# Altium schematic sheet v3.0.SchDoc
size 215 x 114 mm
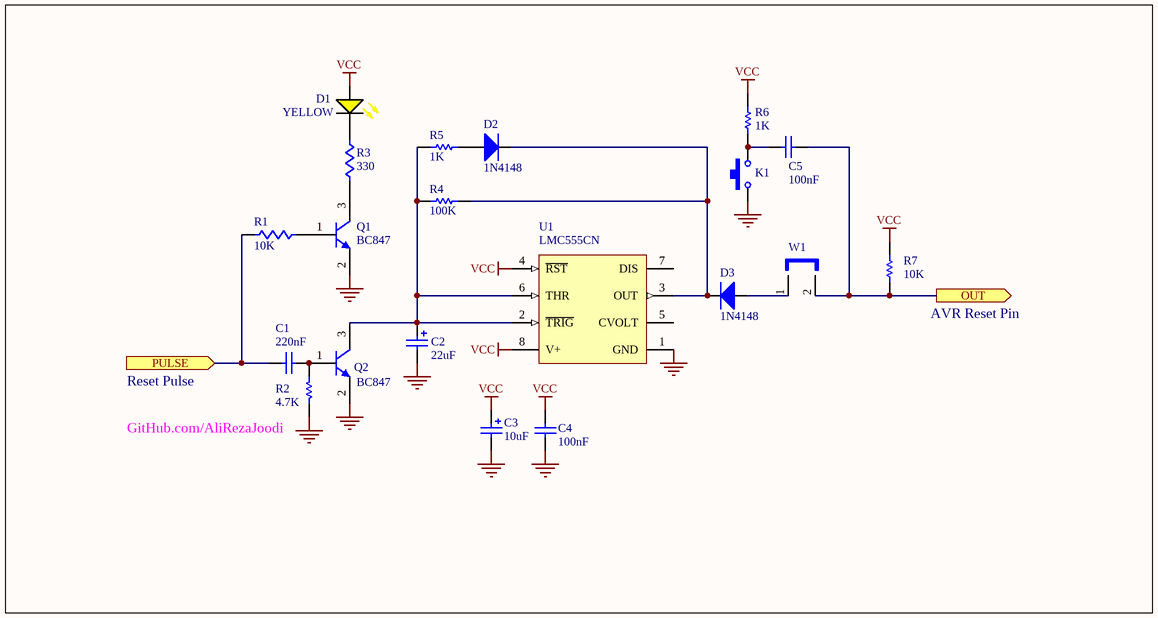
[diagram p0: v3.0.SchDoc]

## Parts
C1  value 220nF  [RESC3216N]  (hidden comment: Cap)
C2  value 22uF  [Cap_B]  (hidden comment: Capacitor)
C3  value 10uF  [Cap_B]  (hidden comment: Capacitor)
C4  value 100nF  [0805]  (hidden comment: Cap)
C5  value 100nF  [0805]  (hidden comment: Cap)
D1  YELLOW  [LED_THD_3MM_YELLOW_R]
D2  value 1N4148  [0805_Diode]  (hidden comment: Diode)
D3  value 1N4148  [0805_Diode]  (hidden comment: Diode)
K1  Switch_SW-PB  [SWPBT_SPST_6X6X4]  (value not drawn)
Q1  value BC847  [SOT23-3N]  (hidden comment: NPN)
Q2  value BC847  [SOT23-3N]  (hidden comment: NPN)
R1  value 10K  [0805]  (hidden comment: RES)
R2  value 4.7K  [0805]  (hidden comment: Res1)
R3  value 330  [0805]  (hidden comment: RES)
R4  value 100K  [0805]  (hidden comment: Res1)
R5  value 1K  [0805]  (hidden comment: Res1)
R6  1K  [0805]
R7  value 10K  [0805]  (hidden comment: Res1)
U1  LMC555CN  [SOP127P636-8N]
W1  Jumper 2pin  [HDR1X2]  (value not drawn)

## Ports
OUT (out), PULSE (in)

## Nets
GND: C2.2 C3.2 C4.1 K1.1 Q1.2(E) Q2.2(E) R2.2 U1.1(GND)
VCC: C3.1 C4.2 D1.1(A) R6.1 R7.1 U1.4(~{RST}) U1.8(V+)
OUT: C5.1 R7.2 W1.2 ; port OUT
PULSE: C1.1 R1.1 ; port PULSE
NetC1_2: C1.2 Q2.1(B) R2.1
NetC2_1: C2.1 Q2.3(C) R4.1 R5.1 U1.2(~{TRIG}) U1.6(THR)
NetC5_2: C5.2 K1.2 R6.2
NetD1_2: D1.2(K) R3.1
NetD2_1: D2.1(A) R5.2
NetD2_2: D2.2(K) D3.2(K) R4.2 U1.3(OUT)
NetD3_1: D3.1(A) W1.1
NetQ1_1: Q1.1(B) R1.2
NetQ1_3: Q1.3(C) R3.2

Not connected (* = marked no-connect by the designer): U1 5(CVOLT) 7(DIS)

## Notes on the sheet
- (near R7) AVR Reset Pin
- (near R2) GitHub.com/AliRezaJoodi
- Reset Pulse

## Library data of the parts
C1 = Cap: Capacitor; Published: 8-Jun-2000; LatestRevisionDate: 17-Jul-2002; LatestRevisionNote: Re-released for DXP Platform.; PackageReference: RAD-0.3; Publisher: Altium Limited
C2 C3 = Cap Pol1: Polarized Capacitor (Radial); Manufacturer: Generic Components; Class I: Passive; Published: 8-Jun-2000; Revision: July-2002: Re-released for DXP Platform.; Publisher: Altium Limited; Class II: Capacitor
C4 C5 = Cap: Capacitor; Manufacturer: Generic Components; Class I: Passive; Published: 8-Jun-2000; Revision: July-2002: Re-released for DXP Platform.; Publisher: Altium Limited; Class II: Capacitor
D1 = LED_YELLOW: LED, Yellow; Manufacturer: Generic Components; Class I: Optoelectronic; Published: 8-Jun-2000; Revision: July-2002: Re-released for DXP Platform.; Publisher: Altium Limited; Class II: LED
D2 D3 = Diode: Default Diode; Manufacturer: Generic Components; Class I: Discrete; Class II: Diode - Switching; Published: 8-Jun-2000; Revision: July-2002: Re-released for DXP Platform.; Publisher: Altium Limited
K1 = Switch_SW-PB_2Form: Switch, SW-PB; Manufacturer: Generic Components; Published: 24-Mar-1999; Revision: July-2002: Re-released for DXP Platform.; Publisher: Altium Limited
Q1 Q2 = BC847: Silicon Bipolar Transistor
R1 R3 R6 R7 = Res1: Resistor; Manufacturer: Generic Components; Class I: Passive; Published: 8-Jun-2000; Revision: July-2002: Re-released for DXP Platform.; Publisher: Altium Limited; Class II: Resistor
R2 R4 R5 = Res1: Resistor; Published: 8-Jun-2000; LatestRevisionDate: 17-Jul-2002; LatestRevisionNote: Re-released for DXP Platform.; PackageReference: AXIAL-0.3; Publisher: Altium Limited
U1 = LMC555CN: CMOS Timer, 8-pin MDIP; Manufacturer: National Semiconductor; PackageTopMarking: NSUZXYTTE#*LMC*555CN; PowerWise: N; CompType: Analog IC; Published: 4-Dec-2008; DatasheetVersion: May-2006; PackageVersion: revG, May-2006; PackageReference: N08E; Publisher: Altium Limited; PackageDescription: MDIP, .365 x .250 x .130in, 8 Lead, .100in Pitch; Supplier 1: Farnell; Supplier Part Number 1: 9488243; PartNumber: LMC555CN; RoHS: N; PinCount: 8; Code_JEDEC: MS-001-BA; ComponentLink1Description: LMC555 Datasheet; ComponentLink1URL: http://www.national.com/ds/LM/LMC555.pdf; ComponentLink2Description: LMC555 Web Page; ComponentLink2URL: http://www.national.com/pf/LM/LMC555.html; ComponentLink3Description: N08E Package Page; ComponentLink3URL: http://www.national.com/packaging/folders/n08e.html
W1 = Jumper 2pin: Jumper Wire; Manufacturer: Generic Components; Published: 24-Mar-1999; Revision: July-2002: Re-released for DXP Platform.; Publisher: Altium Limited